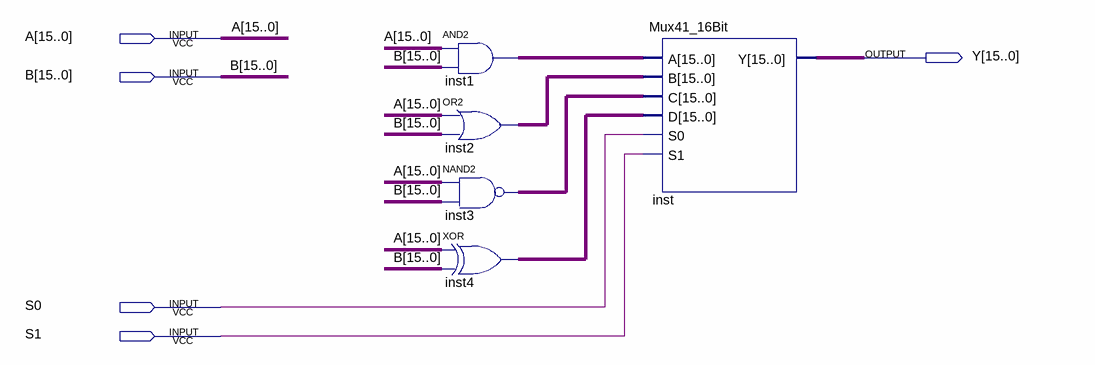
[diagram p0: schematic sheet]
// Quartus schematic LU.bdf as structural Verilog: 5 symbols, 5 pins
module LU (
  input  [15:0] A,
  input  [15:0] B,
  input  S0,
  input  S1,
  output [15:0] Y
);

  wire [15:0] inst1_out, inst2_out, inst3_out, inst4_out;

  assign inst1_out = A & B;  // AND2 inst1, 16 bits wide
  assign inst2_out = A | B;  // OR2 inst2, 16 bits wide
  assign inst3_out = ~(A & B);  // NAND2 inst3, 16 bits wide
  assign inst4_out = A ^ B;  // XOR inst4, 16 bits wide
  Mux41_16Bit inst (.A(inst1_out), .B(inst2_out), .C(inst3_out), .D(inst4_out), .S0(S0), .S1(S1), .Y(Y));
endmodule
